# EAGLE schematic Rover (EAGLE 9.5.1)

## Sheet 1 of 3
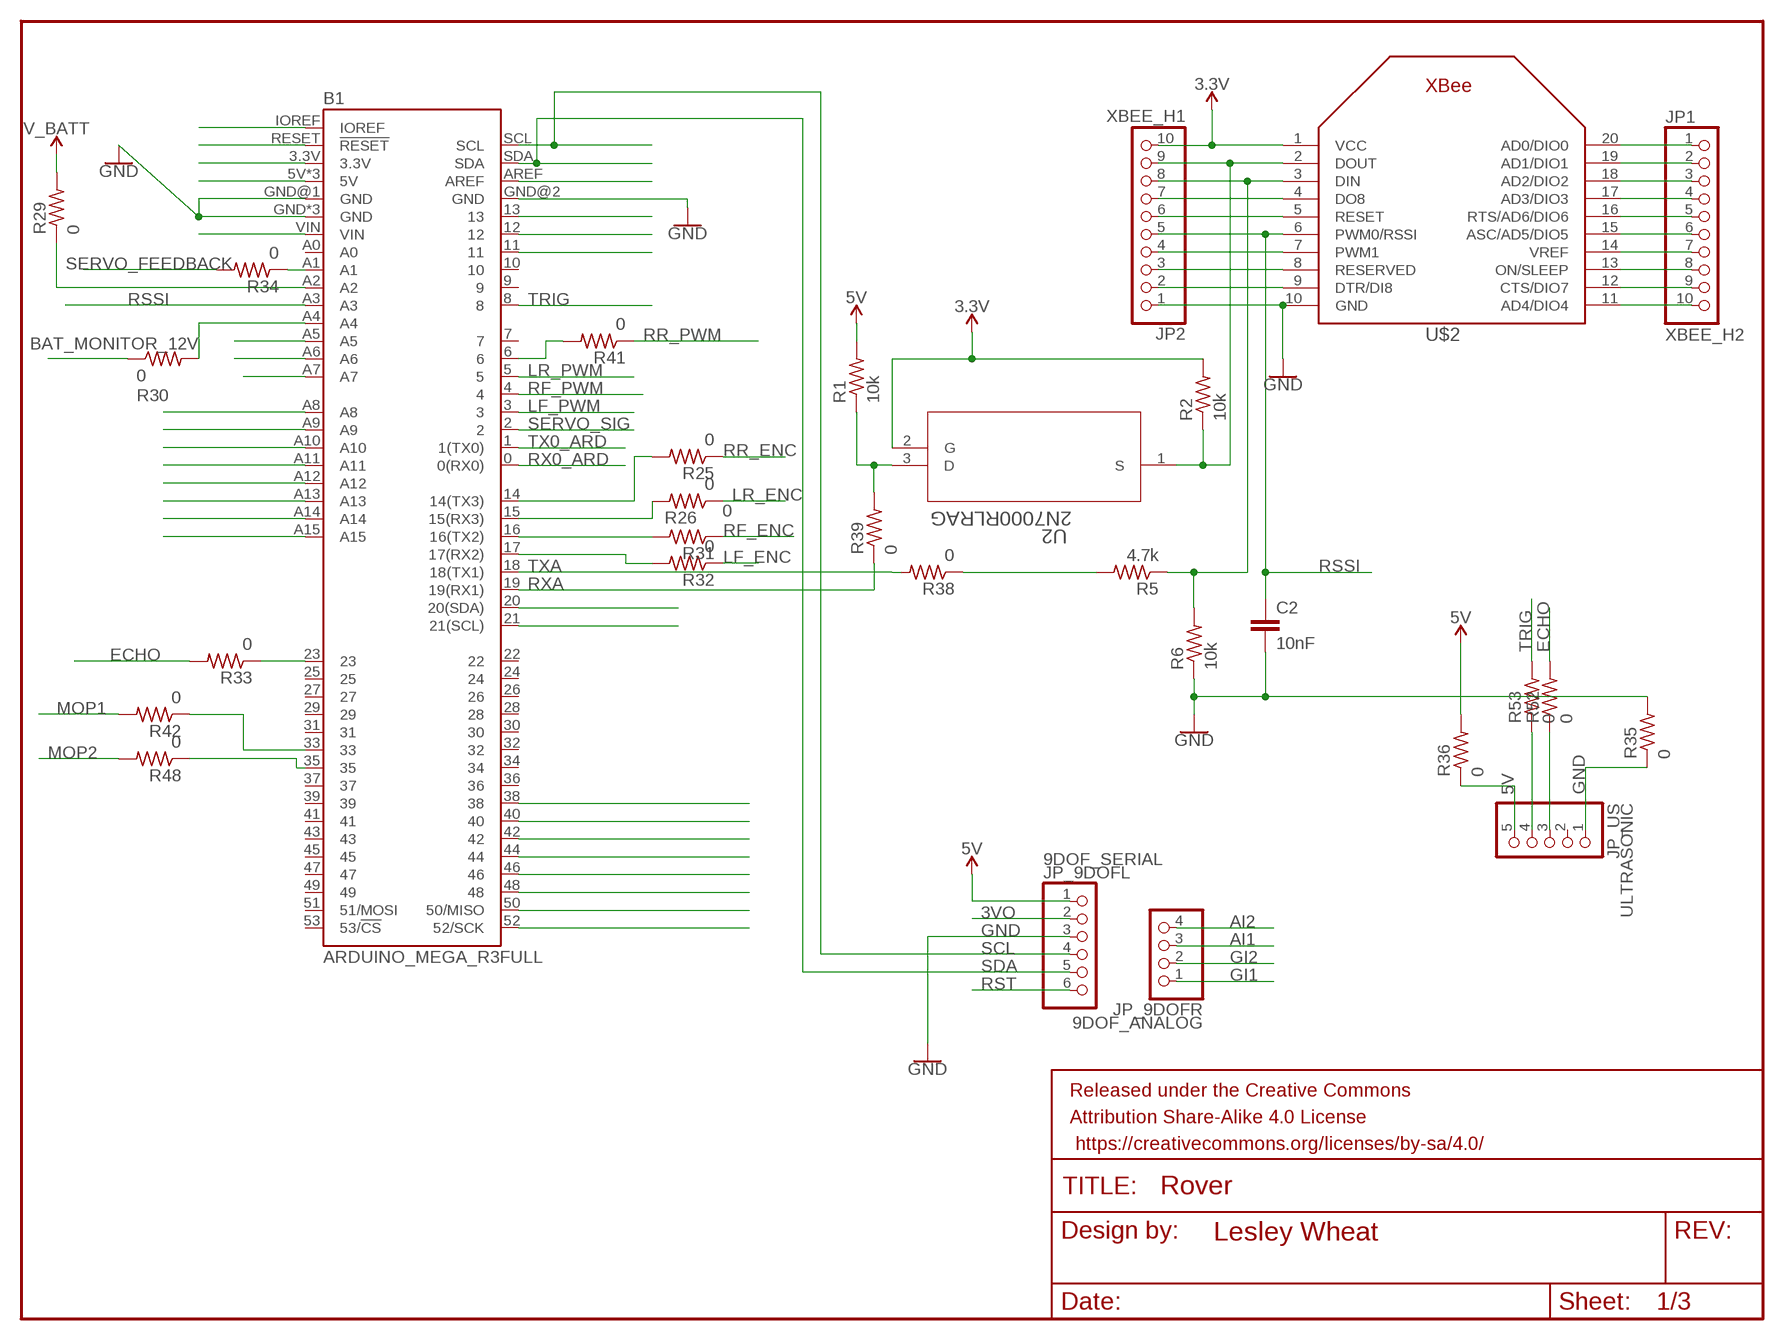
[diagram p0: schematic, sheet 1]

### Parts
B1  ARDUINO_MEGA_R3FULL  [ARDUINO_MEGA_NO_SILK]
C2  10nF  10NF-PTH-10MM-10000V-1-%  [CAP-PTH-10MM]
FRAME1  FRAME-LETTERNO_PACKAGE  [DUMMY]
JP1  XBEE_H2  PINHD-1X10_2.00  [1X10M]
JP2  XBEE_H1  PINHD-1X10_2.00  [1X10M]
JP_9DOFL  PINHD-1X6  [1X06]
JP_9DOFR  PINHD-1X4  [1X04]
JP_US  PINHD-1X5  [1X05]
R1  10k  R-US_0207/12  [0207/12]
R2  10k  R-US_0207/12  [0207/12]
R5  4.7k  R-US_0207/12  [0207/12]
R6  10k  R-US_0207/12  [0207/12]
R25  0  R-US_0207/12  [0207/12]
R26  0  R-US_0207/12  [0207/12]
R29  0  R-US_0207/12  [0207/12]
R30  0  R-US_0207/12  [0207/12]
R31  0  R-US_0207/12  [0207/12]
R32  0  R-US_0207/12  [0207/12]
R33  0  R-US_0207/12  [0207/12]
R34  0  R-US_0207/12  [0207/12]
R35  0  R-US_0207/12  [0207/12]
R36  0  R-US_0207/12  [0207/12]
R38  0  R-US_0207/12  [0207/12]
R39  0  R-US_0207/12  [0207/12]
R41  0  R-US_0207/12  [0207/12]
R42  0  R-US_0207/12  [0207/12]
R48  0  R-US_0207/12  [0207/12]
R52  0  R-US_0207/12  [0207/12]
R53  0  R-US_0207/12  [0207/12]
U2  2N7000RLRAG  [TO-92]
U$2  XBEE  [XBEE]

### Nets
3.3V: JP2.10 R2.2 U2.2(G) U$2.1(VCC) ; also sheet 3
3VO: JP_9DOFL.2
5V: JP_9DOFL.1 R1.2 R36.2 ; also sheet 2,3
AI1: JP_9DOFR.3
AI2: JP_9DOFR.4
BAT_MONITOR_12V: R30.1 ; also sheet 3
DIN: JP2.8 R5.1 R6.2 U$2.3(DIN)
DOUT: JP2.9 R2.1 U2.1(S) U$2.2(DOUT)
ECHO: R33.2 R52.2
GI1: JP_9DOFR.1
GI2: JP_9DOFR.2
GND: B1.GND B1.GND@1(GND) B1.GND@2(GND) B1.GND@3(GND) B1.GND@4(GND) C2.2 JP2.1 JP_9DOFL.3 R6.1 R35.2 U$2.10(GND) ; also sheet 2,3
LF_ENC: R32.1 ; also sheet 2
LF_PWM: B1.3 ; also sheet 2
LR_ENC: R26.1 ; also sheet 2
LR_PWM: B1.5 ; also sheet 2
MOP1: R42.2 ; also sheet 2
MOP2: R48.2 ; also sheet 2
N$1: B1.IOREF
N$2: JP2.3 U$2.8(RESERVED)
N$3: B1.RESET(!RESET)
N$4: B1.6 R41.2
N$5: B1.3.3V
N$6: B1.5V B1.5V@1(5V) B1.5V@2(5V)
N$9: B1.VIN
N$10: JP_US.1 R35.1
N$15: B1.A5
N$16: B1.A6
N$17: B1.A7
N$18: B1.A8
N$19: B1.A9
N$20: B1.A10
N$21: B1.A11
N$22: B1.A12
N$23: B1.A13
N$24: B1.A14
N$25: B1.A15
N$29: JP1.1 U$2.20(AD0/DIO0)
N$37: JP1.2 U$2.19(AD1/DIO1)
N$38: JP1.3 U$2.18(AD2/DIO2)
N$39: JP1.4 U$2.17(AD3/DIO3)
N$40: JP1.5 U$2.16(RTS/AD6/DIO6)
N$41: JP1.6 U$2.15(ASC/AD5/DIO5)
N$42: JP1.7 U$2.14(VREF)
N$43: JP1.8 U$2.13(ON/SLEEP)
N$44: JP1.9 U$2.12(CTS/DIO7)
N$45: JP1.10 U$2.11(AD4/DIO4)
N$46: JP2.2 U$2.9(DTR/DI8)
N$47: JP2.4 U$2.7(PWM1)
N$49: JP2.6 U$2.5(RESET)
N$50: JP2.7 U$2.4(DO8)
N$52: B1.35 R48.1
N$56: B1.14(14(TX3)) R25.2
N$57: B1.16(16(TX2)) R31.2
N$60: B1.A2 R29.1
N$61: B1.A4 R30.2
N$62: B1.23 R33.1
N$63: B1.15(15(RX3)) R26.2
N$64: B1.38
N$65: B1.40
N$66: B1.42
N$67: B1.44
N$68: B1.46
N$69: B1.48
N$70: B1.50(50/MISO)
N$71: B1.52(52/SCK)
N$72: B1.17(17(RX2)) R32.2
N$73: B1.A1 R34.1
N$74: JP_US.5 R36.1
N$75: B1.AREF
N$76: R5.2 R38.1
N$77: B1.13
N$78: B1.12
N$79: B1.11
N$81: R1.1 R39.2 U2.3(D)
N$83: B1.33 R42.1
N$87: JP_US.3 R52.1
N$88: JP_US.4 R53.1
N$93: B1.20(20(SDA))
N$94: B1.21(21(SCL))
RF_ENC: R31.1 ; also sheet 2
RF_PWM: B1.4 ; also sheet 2
RR_ENC: R25.1 ; also sheet 2
RR_PWM: R41.1 ; also sheet 2
RSSI: B1.A3 C2.1 JP2.5 U$2.6(PWM0/RSSI)
RST: JP_9DOFL.6
RX0_ARD: B1.0(0(RX0)) ; also sheet 3
RXA: B1.19(19(RX1)) R39.1
SCL: B1.SCL JP_9DOFL.4
SDA: B1.SDA JP_9DOFL.5
SERVO_FEEDBACK: R34.2 ; also sheet 2
SERVO_SIG: B1.2 ; also sheet 2
TRIG: B1.8 R53.2
TX0_ARD: B1.1(1(TX0)) ; also sheet 3
TXA: B1.18(18(TX1)) R38.2
V_BATT: R29.2 ; also sheet 3
Unconnected: B1.7 B1.9 B1.10 B1.22 B1.24 B1.25 B1.26 B1.27 B1.28 B1.29 B1.30 B1.31 B1.32 B1.34 B1.36 B1.37 B1.39 B1.41 B1.43 B1.45 B1.47 B1.49 B1.51(51/MOSI) B1.53(53/!CS) B1.A0 JP_US.2

## Sheet 2 of 3
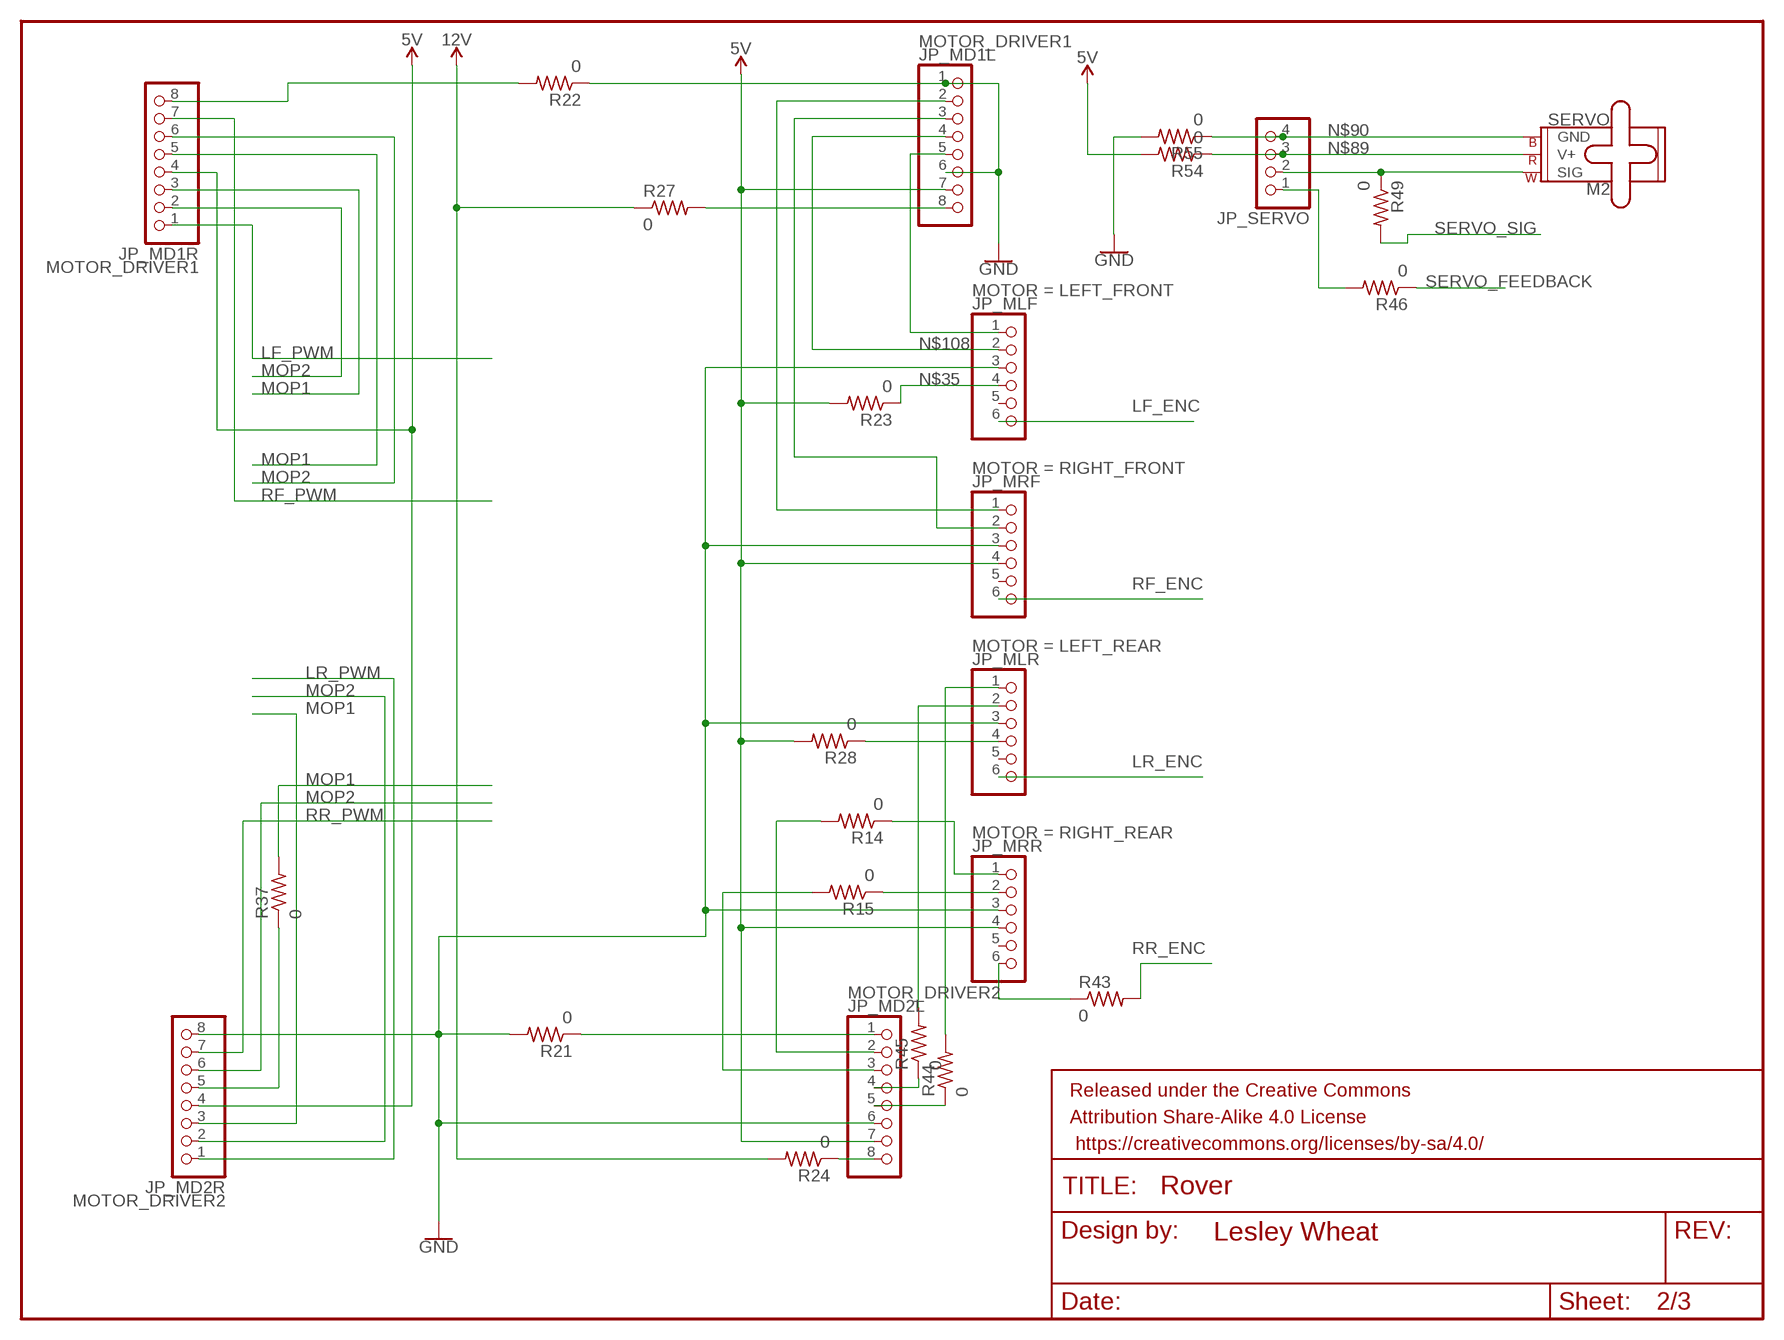
[diagram p1: schematic, sheet 2]

### Parts
FRAME2  FRAME-LETTERNO_PACKAGE  [DUMMY]
JP_MD1L  PINHD-1X8  [1X08]
JP_MD1R  PINHD-1X8  [1X08]
JP_MD2L  PINHD-1X8  [1X08]
JP_MD2R  PINHD-1X8  [1X08]
JP_MLF  PINHD-1X6  [1X06]
JP_MLR  PINHD-1X6  [1X06]
JP_MRF  PINHD-1X6  [1X06]
JP_MRR  PINHD-1X6  [1X06]
JP_SERVO  PINHD-1X4  [1X04]
M2  SERVO  [1X03]
R14  0  R-US_0207/12  [0207/12]
R15  0  R-US_0207/12  [0207/12]
R21  0  R-US_0207/12  [0207/12]
R22  0  R-US_0207/12  [0207/12]
R23  0  R-US_0207/12  [0207/12]
R24  0  R-US_0207/12  [0207/12]
R27  0  R-US_0207/12  [0207/12]
R28  0  R-US_0207/12  [0207/12]
R37  0  R-US_0207/12  [0207/12]
R43  0  R-US_0207/12  [0207/12]
R44  0  R-US_0207/12  [0207/12]
R45  0  R-US_0207/12  [0207/12]
R46  0  R-US_0207/12  [0207/12]
R49  0  R-US_0207/12  [0207/12]
R54  0  R-US_0207/12  [0207/12]
R55  0  R-US_0207/12  [0207/12]

### Nets
5V: JP_MD1L.7 JP_MD1R.4 JP_MD2L.7 JP_MD2R.4 JP_MRF.4 JP_MRR.4 R23.2 R28.2 R54.2 ; also sheet 1,3
12V: R24.2 R27.1 ; also sheet 3
GND: JP_MD1L.1 JP_MD1L.6 JP_MD2L.6 JP_MD2R.8 JP_MLF.3 JP_MLR.3 JP_MRF.3 JP_MRR.3 R21.2 R22.1 R55.2 ; also sheet 1,3
LF_ENC: JP_MLF.6 ; also sheet 1
LF_PWM: JP_MD1R.1 ; also sheet 1
LR_ENC: JP_MLR.6 ; also sheet 1
LR_PWM: JP_MD2R.1 ; also sheet 1
MOP1: JP_MD1R.3 JP_MD1R.5 JP_MD2R.3 R37.2 ; also sheet 1
MOP2: JP_MD1R.2 JP_MD1R.6 JP_MD2R.2 JP_MD2R.6 ; also sheet 1
N$7: JP_MRR.1 R14.1
N$27: JP_MRR.2 R15.1
N$33: JP_MD2L.1 R21.1
N$34: JP_MD1R.8 R22.2
N$35: JP_MLF.4 R23.1
N$36: JP_SERVO.1 R46.2
N$51: JP_SERVO.2 M2.1(SIG) R49.1
N$53: JP_MD2L.8 R24.1
N$58: JP_MLR.4 R28.1
N$59: JP_MD1L.8 R27.2
N$80: JP_MD2R.5 R37.1
N$84: JP_MRR.6 R43.1
N$85: JP_MD2L.4 R45.1
N$86: JP_MD2L.5 R44.1
N$89: JP_SERVO.3 M2.2(V+) R54.1
N$90: JP_SERVO.4 M2.3(GND) R55.1
N$98: JP_MLR.1 R44.2
N$102: JP_MLR.2 R45.2
N$103: JP_MD2L.3 R15.2
N$105: JP_MD2L.2 R14.2
N$106: JP_MD1L.5 JP_MLF.1
N$108: JP_MD1L.4 JP_MLF.2
N$109: JP_MD1L.3 JP_MRF.2
N$111: JP_MD1L.2 JP_MRF.1
RF_ENC: JP_MRF.6 ; also sheet 1
RF_PWM: JP_MD1R.7 ; also sheet 1
RR_ENC: R43.2 ; also sheet 1
RR_PWM: JP_MD2R.7 ; also sheet 1
SERVO_FEEDBACK: R46.1 ; also sheet 1
SERVO_SIG: R49.2 ; also sheet 1
Unconnected: JP_MLF.5 JP_MLR.5 JP_MRF.5 JP_MRR.5

## Sheet 3 of 3
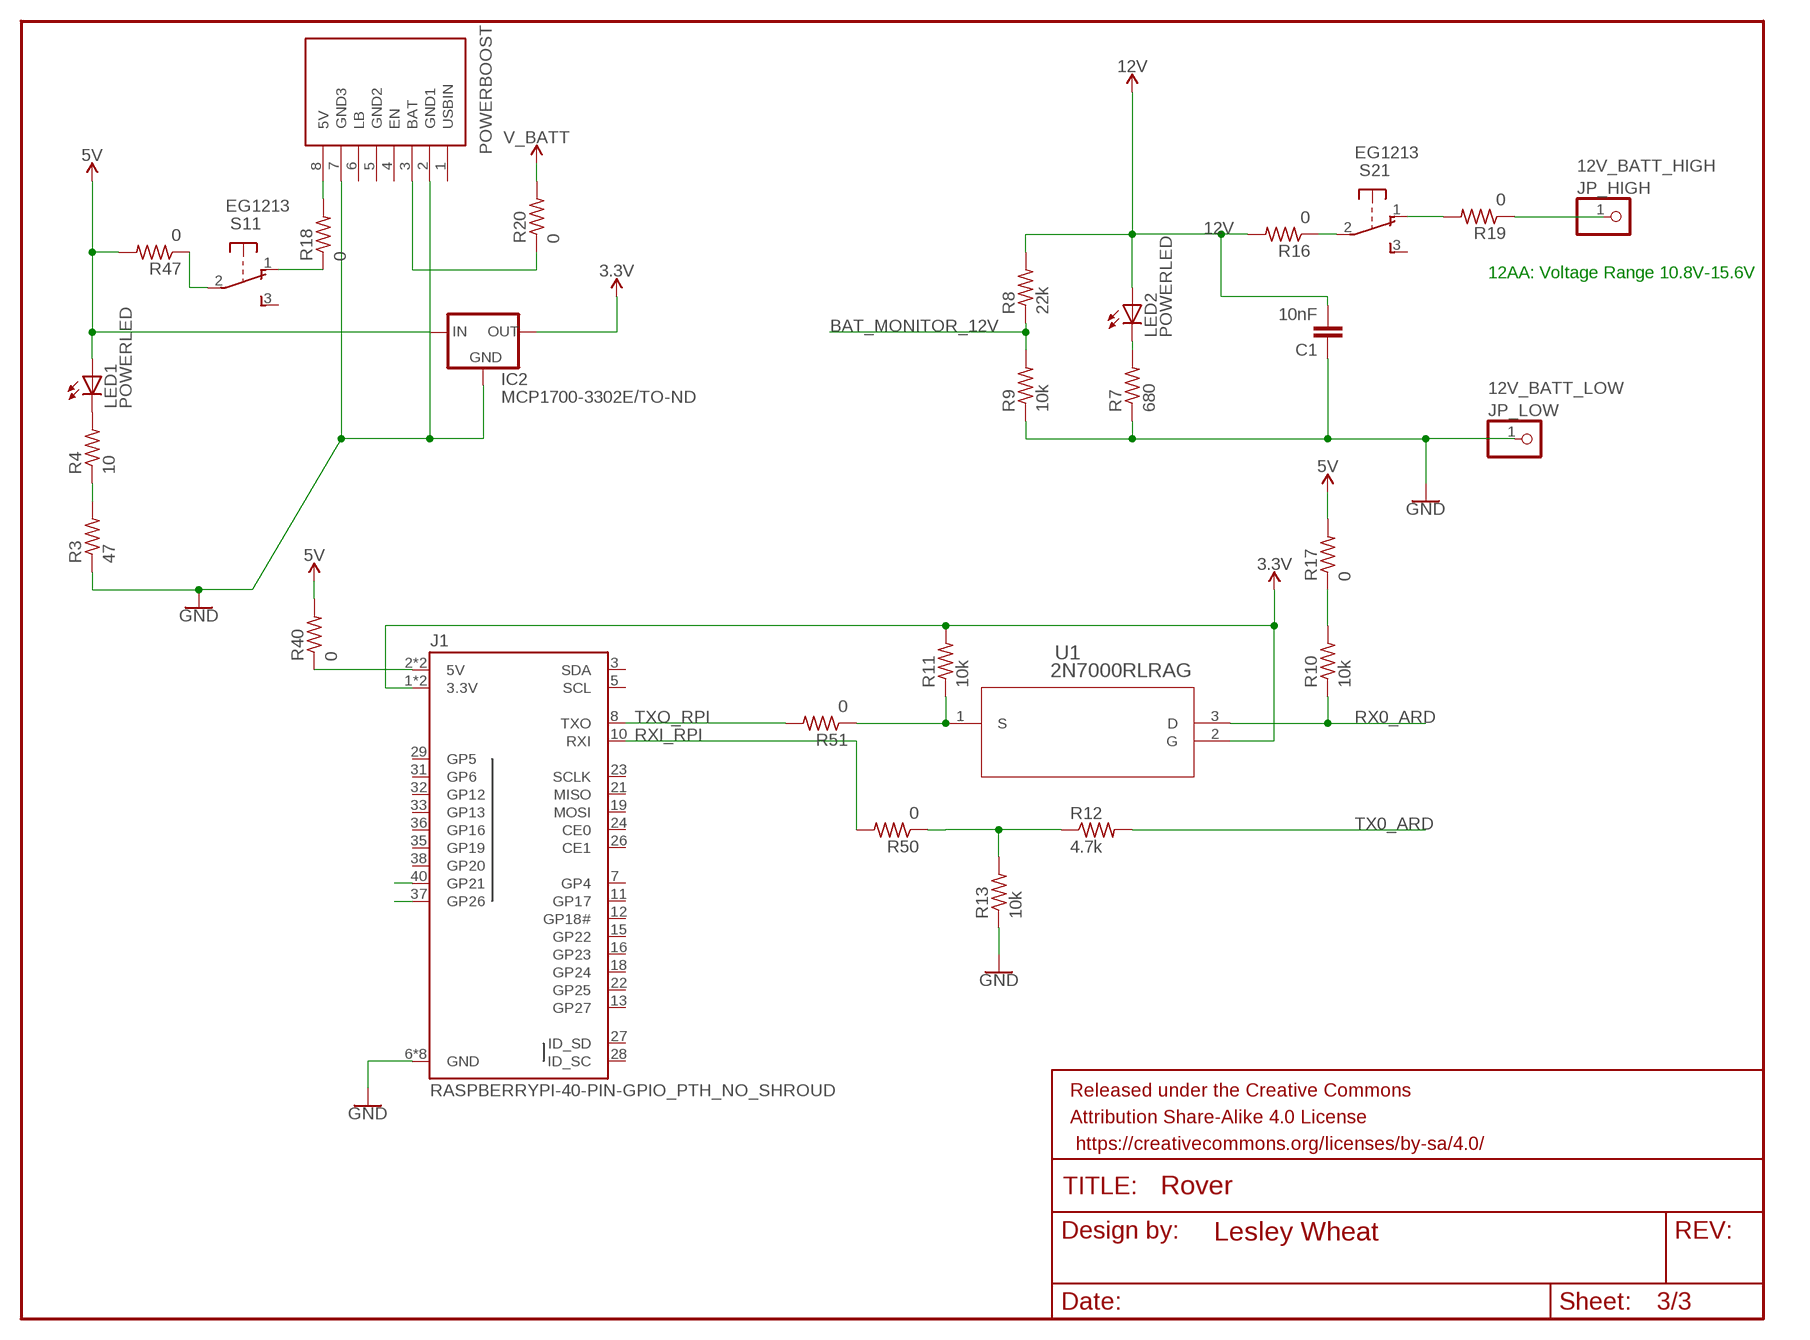
[diagram p2: schematic, sheet 3]

### Parts
C1  10nF  10NF-PTH-10MM-10000V-1-%  [CAP-PTH-10MM]
FRAME3  FRAME-LETTERNO_PACKAGE  [DUMMY]
IC2  MCP1700-3302E/TO-ND  MCP1700INLINE  [TO92-INLINE]
J1  RASPBERRYPI-40-PIN-GPIO_PTH_NO_SHROUD  [2X20]
JP_HIGH  PINHD-1X1  [1X01]
JP_LOW  PINHD-1X1  [1X01]
LED1  POWERLED  LED5MM  [LED5MM]
LED2  POWERLED  LED5MM  [LED5MM]
R3  47  R-US_0207/12  [0207/12]
R4  10  R-US_0207/12  [0207/12]
R7  680  R-US_0207/12  [0207/12]
R8  22k  R-US_0207/12  [0207/12]
R9  10k  R-US_0207/12  [0207/12]
R10  10k  R-US_0207/12  [0207/12]
R11  10k  R-US_0207/12  [0207/12]
R12  4.7k  R-US_0207/12  [0207/12]
R13  10k  R-US_0207/12  [0207/12]
R16  0  R-US_0207/12  [0207/12]
R17  0  R-US_0207/12  [0207/12]
R18  0  R-US_0207/12  [0207/12]
R19  0  R-US_0207/12  [0207/12]
R20  0  R-US_0207/12  [0207/12]
R40  0  R-US_0207/12  [0207/12]
R47  0  R-US_0207/12  [0207/12]
R50  0  R-US_0207/12  [0207/12]
R51  0  R-US_0207/12  [0207/12]
S1  EG1213  [EG1213]
S2  EG1213  [EG1213]
U1  2N7000RLRAG  [TO-92]
U$1  POWERBOOST500C  [POWERBOOST500]

### Nets
3.3V: IC2.3(OUT) J1.1(3.3V) J1.17(3.3V) R11.2 U1.2(G) ; also sheet 1
5V: IC2.2(IN) LED1.A R17.2 R40.2 R47.2 ; also sheet 1,2
12V: C1.2 LED2.A R8.2 R16.2 ; also sheet 2
BAT_MONITOR_12V: R8.1 R9.2 ; also sheet 1
GND: C1.1 IC2.1(GND) J1.6(GND) J1.9(GND) J1.14(GND) J1.20(GND) J1.25(GND) J1.30(GND) J1.34(GND) J1.39(GND) JP_LOW.1 R3.1 R7.1 R9.1 R13.1 U$1.2(GND1) U$1.7(GND3) ; also sheet 1,2
N$8: J1.40(GP21)
N$11: R19.2 S2.1(1:O)
N$12: LED2.K(C) R7.2
N$13: J1.37(GP26)
N$14: R10.2 R17.1
N$26: R18.2 U$1.8(5V)
N$28: R16.1 S2.2(1:P)
N$30: R18.1 S1.1(1:O)
N$31: JP_HIGH.1 R19.1
N$32: R20.1 U$1.3(BAT)
N$48: R47.1 S1.2(1:P)
N$54: R12.1 R13.2 R50.1
N$55: R11.1 R51.1 U1.1(S)
N$82: J1.2(5V) J1.4(5V) R40.1
N$96: LED1.K(C) R4.2
N$97: R3.2 R4.1
RX0_ARD: R10.1 U1.3(D) ; also sheet 1
RXI_RPI: J1.10(RXI) R50.2
TX0_ARD: R12.2 ; also sheet 1
TXO_RPI: J1.8(TXO) R51.2
V_BATT: R20.2 ; also sheet 1
Unconnected: J1.3(SDA) J1.5(SCL) J1.7(GP4) J1.11(GP17) J1.12(GP18#) J1.13(GP27) J1.15(GP22) J1.16(GP23) J1.18(GP24) J1.19(MOSI) J1.21(MISO) J1.22(GP25) J1.23(SCLK) J1.24(CE0) J1.26(CE1) J1.27(ID_SD) J1.28(ID_SC) J1.29(GP5) J1.31(GP6) J1.32(GP12) J1.33(GP13) J1.35(GP19) J1.36(GP16) J1.38(GP20) S1.3(1:S) S1.MT1(MT) S1.MT2(MT) S2.3(1:S) S2.MT1(MT) S2.MT2(MT) U$1.1(USBIN) U$1.4(EN) U$1.5(GND2) U$1.6(LB)

### Notes on the sheet
- 12AA: Voltage Range 10.8V-15.6V

## Library data of the parts
B1 = SparkFun-Boards:ARDUINO_MEGA_R3: Arduino Mega R3 ATmega2560 R3 compatible footprint. SparkFun Products: Arduino Mega 2560 R3 <https://www.sparkfun.com/products/11061>
C1 C2 = SparkFun-Capacitors:10NF: 0.01uF/10nF/10,000pF ceramic capacitors A capacitor is a passive two-terminal electrical component used to store electrical energy temporarily in an electric field. CAP-09321; PROD_ID: CAP-09321
FRAME1-FRAME3 = SparkFun-Aesthetics:FRAME-LETTER: Schematic Frame - Letter Standard 8.5x11 US Letter frame; DESIGNER: Lesley Wheat; VERSION: v01
IC2 = adafruit:MCP1700: VOLTAGE REGULATOR
J1 = SparkFun-Connectors:RASPBERRYPI-40-PIN-GPIO: Raspberry Pi GPIO Header 2x20 pin connector, as found on B, B+, A+ models. Both shrouded PTH and SMT versions available. SparkFun Products: GPIO Shrouded Header <https://www.sparkfun.com/products/13054>- PTH SparkFun Pi Wedge (Preassembled) <https://www.sparkfun.com/products/13717>
JP1 JP2 = pinhead-2:PINHD-1X10: PIN HEADER
JP_9DOFL = pinhead:PINHD-1X6: PIN HEADER
JP_9DOFR JP_SERVO = pinhead:PINHD-1X4: PIN HEADER
JP_HIGH JP_LOW = pinhead:PINHD-1X1: PIN HEADER
JP_MD1L JP_MD1R JP_MD2L JP_MD2R = pinhead:PINHD-1X8: PIN HEADER
JP_MLF = pinhead:PINHD-1X6: PIN HEADER; MOTOR: LEFT_FRONT
JP_MLR = pinhead:PINHD-1X6: PIN HEADER; MOTOR: LEFT_REAR
JP_MRF = pinhead:PINHD-1X6: PIN HEADER; MOTOR: RIGHT_FRONT
JP_MRR = pinhead:PINHD-1X6: PIN HEADER; MOTOR: RIGHT_REAR
JP_US = pinhead:PINHD-1X5: PIN HEADER
LED1 LED2 = led:LED: LED OSRAM: - CHIPLED LG R971, LG N971, LY N971, LG Q971, LY Q971, LO R971, LY R971 LH N974, LH R974 LS Q976, LO Q976, LY Q976 LO Q996 - Hyper CHIPLED LW Q18S LB Q993, LB Q99A, LB R99A - SideLED LS A670, LO A670, LY A670, LG A670, LP A670 LB A673, LV A673, LT A673, LW A673 LH A674 LY A675 LS A676, LA A676, LO A676, LY A676, LW A676 LS A679, LY A679, LG A679 - Hyper Micro SIDELED® LS Y876, LA Y876, LO Y876, LY Y876 LT Y87S - SmartLED LW L88C, LW L88S LB L89C, LB L89S, LG L890 LS L89K, LO L89K, LY L89K LS L896, LA L896, LO L896, LY L896 - TOPLED LS T670, LO T670, LY T670, LG T670, LP T670 LSG T670, LSP T670, LSY T670, LOP T670, LYG T670 LG T671, LOG T671, LSG T671 LB T673, LV T673, LT T673, LW T673 LH T674 LS T676, LA T676, LO T676, LY T676, LB T676, LH T676, LSB T676, LW T676 LB T67C, LV T67C, LT T67C, LS T67K, LO T67K, LY T67K, LW E67C LS E67B, LA E67B, LO E67B, LY E67B, LB E67C, LV E67C, LT E67C LW T67C LS T679, LY T679, LG T679 LS T770, LO T770, LY T770, LG T770, LP T770 LB T773, LV T773, LT T773, LW T773 LH T774 LS E675, LA E675, LY E675, LS T675 LS T776, LA T776, LO T776, LY T776, LB T776 LHGB T686 LT T68C, LB T68C - Hyper Mini TOPLED® LB M676 - Mini TOPLED Santana® LG M470 LS M47K, LO M47K, LY M47K Source: http://www.osram.convergy.de LUXEON: - LUMILED® LXK2-PW12-R00, LXK2-PW12-S00, LXK2-PW14-U00, LXK2-PW14-V00 LXK2-PM12-R00, LXK2-PM12-S00, LXK2-PM14-U00 LXK2-PE12-Q00, LXK2-PE12-R00, LXK2-PE12-S00, LXK2-PE14-T00, LXK2-PE14-U00 LXK2-PB12-K00, LXK2-PB12-L00, LXK2-PB12-M00, LXK2-PB14-N00, LXK2-PB14-P00, LXK2-PB14-Q00 LXK2-PR12-L00, LXK2-PR12-M00, LXK2-PR14-Q00, LXK2-PR14-R00 LXK2-PD12-Q00, LXK2-PD12-R00, LXK2-PD12-S00 LXK2-PH12-R00, LXK2-PH12-S00 LXK2-PL12-P00, LXK2-PL12-Q00, LXK2-PL12-R00 Source: www.luxeon.com KINGBRIGHT: KA-3528ASYC Source: www.kingbright.com
M2 = SparkFun-Electromechanical:SERVO: Servo Motor 3-pin connector for a standard servo motor (voltage supply, ground, and control signal.) SparkFun Products Servo - Generic (Sub-Micro Size) <https://www.sparkfun.com/products/9065> (ROB-09065) Servo - Generic High Torque Continuous Rotation (Standard Size) <https://www.sparkfun.com/products/9347> (ROB-09347) Servo - Generic High Torque (Standard Size) <https://www.sparkfun.com/products/11965> (ROB-11965)
R1-R55 = resistor:R-US_: RESISTOR, American symbol
S1 S2 = adafruit:EG1213: E-Switch right-angle slide SPDT Part #EG1213 http://www.ladyada.net/library/eagle
U1 U2 = 2N7000RLRAG:2N7000RLRAG; BUILT_BY: EMA_UL_Team; MANUFACTURER_PART_NUMBER: 2N7000RLRAG; VENDOR: ON Semiconductor
U$1 = jos-ph:POWERBOOST500C: Adafruit PowerBoost 500c https://www.adafruit.com/products/1944 *UNPROVEN*
U$2 = adafruit:XBEE